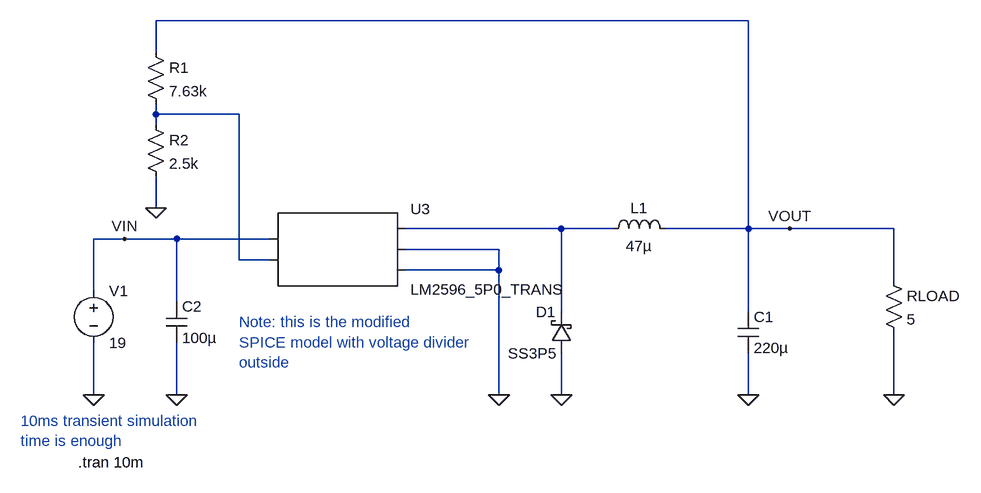
[diagram p0: schematic lm2596-modified-5v-load-5-ohm-transient-10ms.asc]
lm2596-modified-5v-load-5-ohm-transient-10ms.asc, the LTspice schematic file:
Version 4
SHEET 1 1864 788
WIRE 864 -256 -48 -256
WIRE -48 -208 -48 -256
WIRE -48 -112 -48 -128
WIRE 80 -112 -48 -112
WIRE -48 -96 -48 -112
WIRE -48 32 -48 -16
WIRE 576 64 336 64
WIRE 656 64 576 64
WIRE 864 64 864 -256
WIRE 864 64 736 64
WIRE 928 64 864 64
WIRE 1088 64 928 64
WIRE -96 80 -144 80
WIRE -16 80 -96 80
WIRE 128 80 -16 80
WIRE 480 96 336 96
WIRE 80 112 80 -112
WIRE 128 112 80 112
WIRE 480 128 480 96
WIRE 480 128 336 128
WIRE 1088 144 1088 64
WIRE -144 160 -144 80
WIRE -16 176 -16 80
WIRE 576 192 576 64
WIRE 864 192 864 64
WIRE -144 320 -144 240
WIRE -16 320 -16 240
WIRE 480 320 480 128
WIRE 576 320 576 256
WIRE 864 320 864 256
WIRE 1088 320 1088 224
FLAG -144 320 0
FLAG 480 320 0
FLAG 576 320 0
FLAG 864 320 0
FLAG -16 320 0
FLAG -48 32 0
FLAG 1088 320 0
FLAG -96 80 VIN
FLAG 928 64 VOUT
SYMBOL cap 848 192 R0
SYMATTR InstName C1
SYMATTR Value 220µ
SYMBOL ind 640 80 R270
WINDOW 0 32 56 VTop 2
WINDOW 3 5 56 VBottom 2
SYMATTR InstName L1
SYMATTR Value 47µ
SYMBOL voltage -144 144 R0
WINDOW 123 0 0 Left 0
WINDOW 39 0 0 Left 0
SYMATTR InstName V1
SYMATTR Value 19
SYMBOL cap -32 176 R0
SYMATTR InstName C2
SYMATTR Value 100µ
SYMBOL schottky 592 256 R180
WINDOW 0 24 64 Left 2
WINDOW 3 24 0 Left 2
SYMATTR InstName D1
SYMATTR Value SS3P5
SYMATTR Description Diode
SYMATTR Type diode
SYMBOL AutoGenerated\\LM2596_5P0_TRANS 224 96 R0
SYMATTR InstName U3
SYMBOL res -64 -224 R0
SYMATTR InstName R1
SYMATTR Value 7.63k
SYMBOL res -64 -112 R0
SYMATTR InstName R2
SYMATTR Value 2.5k
SYMBOL res 1072 128 R0
SYMATTR InstName RLOAD
SYMATTR Value 5
TEXT -168 424 Left 2 !.tran 10m
TEXT 80 208 Left 2 ;Note: this is the modified\nSPICE model with voltage divider\noutside
TEXT -256 360 Left 2 ;10ms transient simulation \ntime is enough

The netlist it stands for:
* lm2596-modified-5v-load-5-ohm-transient-10ms.asc
C1 VOUT 0 220µ
L1 N002 VOUT 47µ
V1 VIN 0 19
C2 VIN 0 100µ
D1 0 N002 SS3P5
* U3: LM2596_5P0_TRANS (symbol AutoGenerated\LM2596_5P0_TRANS not available, pins judged from their places): pin1=VIN pin2=N001 pin3=N002 pin4=0 pin5=0
R1 VOUT N001 7.63k
R2 N001 0 2.5k
RLOAD VOUT 0 5
.model D D
.lib standard.dio
.tran 10m
* Note: this is the modified
* SPICE model with voltage divider
* outside
* 10ms transient simulation
* time is enough
.backanno
.end